# EAGLE design YOTSUBA_GNSS-receiver_MAX_ver.1.5b (EAGLE 9.6.2)
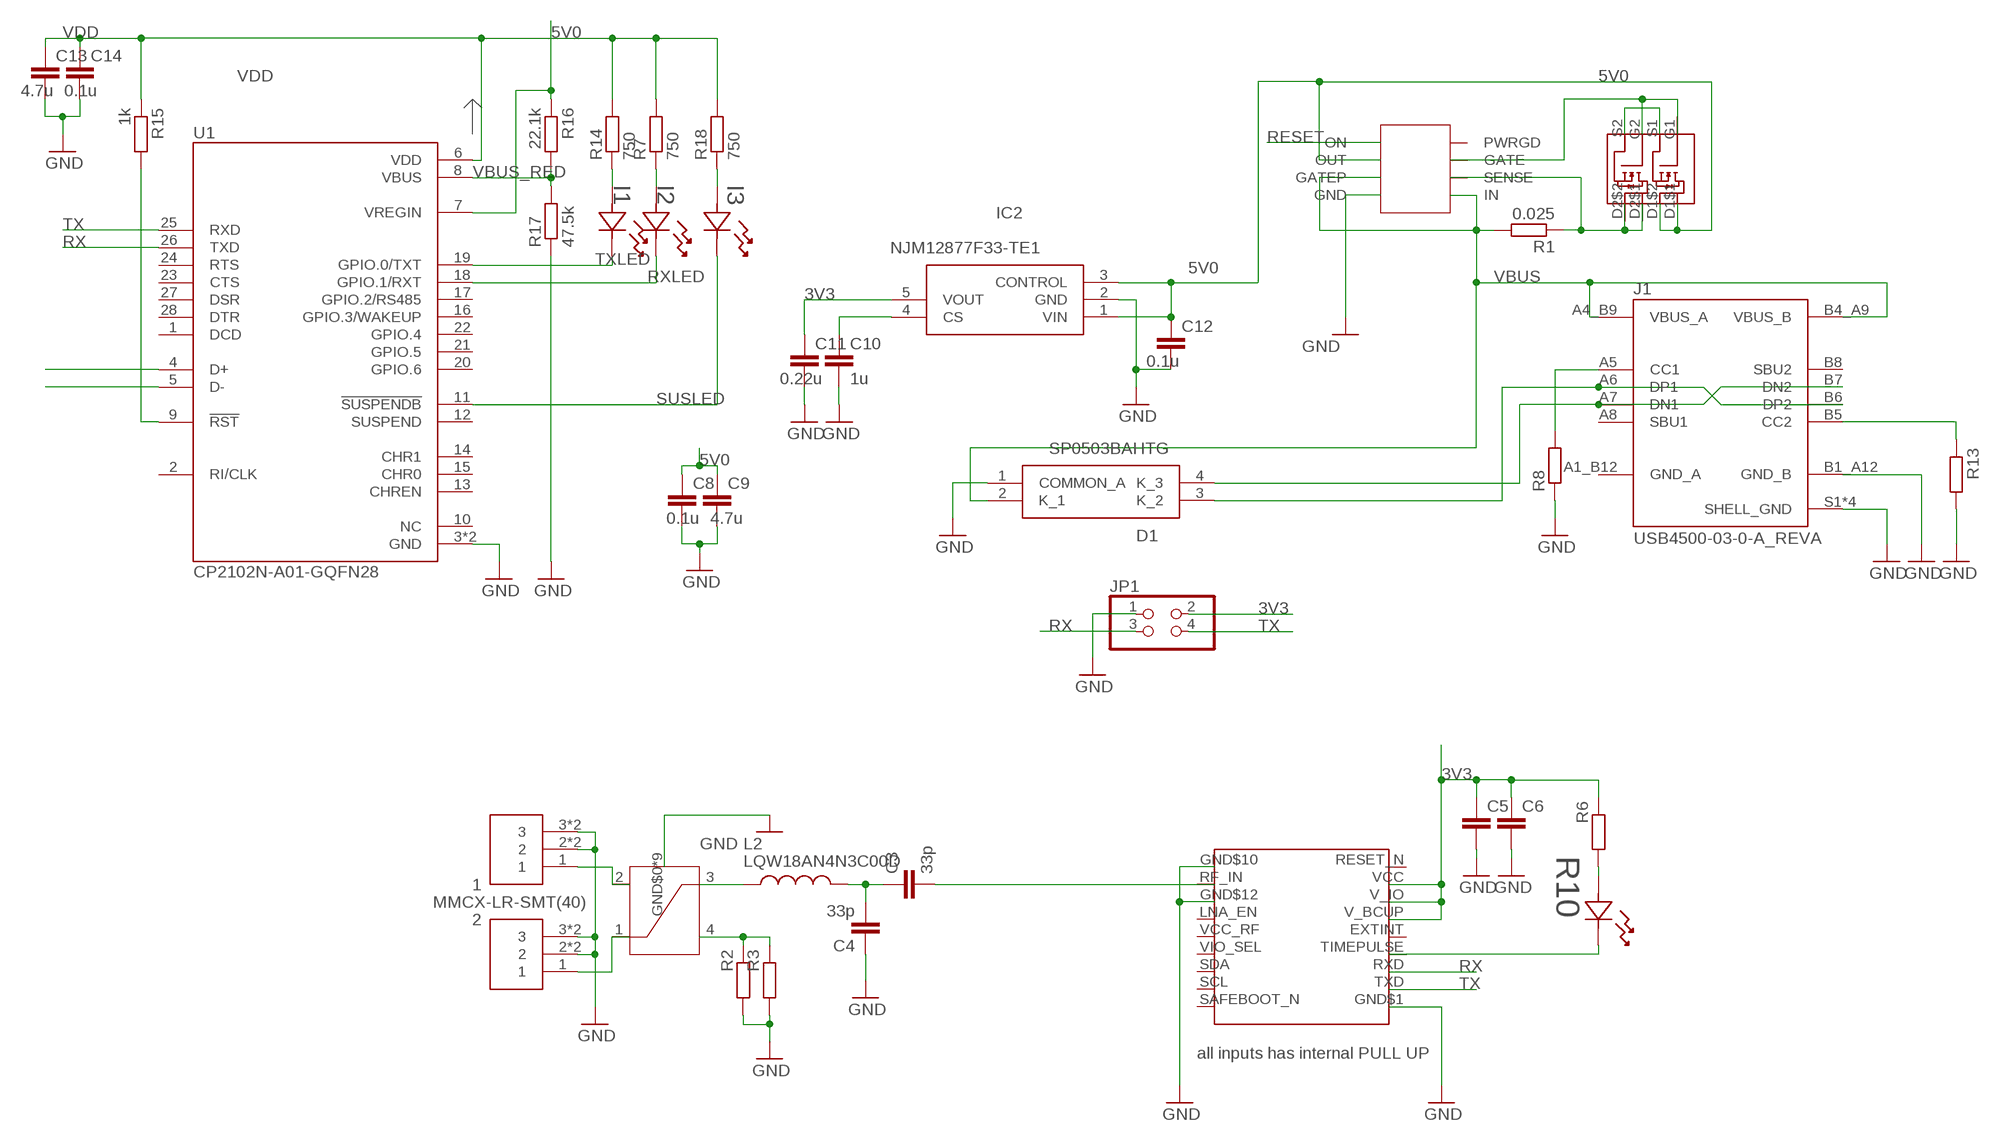
[diagram p0: schematic, sheet 1]

## Parts
1  MMCX-LR-SMT(40)  [MMCX-LR-SMT(40)]
2  MMCX-LR-SMT(40)  [MMCX-LR-SMT(40)]
C3  33p  C-EUC1608  [C1608]
C4  33p  C-EUC1608  [C1608]
C5  C-EUC1608  [C1608]
C6  C-EUC1608  [C1608]
C8  0.1u  C-EUC1608  [C1608]
C9  4.7u  C-EUC1608  [C1608]
C10  1u  C-EUC1608  [C1608]
C11  0.22u  C-EUC1608  [C1608]
C12  0.1u  C-EUC1608  [C1608]
C13  4.7u  C-EUC1608  [C1608]
C14  0.1u  C-EUC1608  [C1608]
D1  SP0503BAHTG  [SP0503BAHTG]
I1  SML-E12P8WT86  [LED_SMLD12_ROM]
I2  SML-E12P8WT86  [LED_SMLD12_ROM]
I3  SML-E12P8WT86  [LED_SMLD12_ROM]
IC2  NJM12877F33-TE1  [SOT95P280X120-5N]
J1  USB4500-03-0-A_REVA  [GCT_USB4500-03-0-A_REVA]
JP1  PINHD-2X2  [2X02]
L2  LQW18AN4N3C00D  [INDC1608X100N]
R1  0.025  R-EU_R0603  [R0603]
R2  R-EU_R0603  [R0603]
R3  R-EU_R0603  [R0603]
R6  R-EU_R0603  [R0603]
R7  750  R-EU_R0603  [R0603]
R8  R-EU_R0603  [R0603]
R10  SML-E12P8WT86  [LED_SMLD12_ROM]
R13  R-EU_R0603  [R0603]
R14  750  R-EU_R0603  [R0603]
R15  1k  R-EU_R0603  [R0603]
R16  22.1k  R-EU_R0603  [R0603]
R17  47.5k  R-EU_R0603  [R0603]
R18  750  R-EU_R0603  [R0603]
U1  CP2102N-A01-GQFN28  [QFN50P500X500X80-29N]
U$1  MAX_M10S  [MAX-M10S]
U$3  HC125.A  [HC125.A]
U$7  DMG6898LSD  [SOIC127P600X150-8N]
U$8  LTC4361  [SOP65P280X100-8N]

## Nets
3V3 [POWER]: C5.1 C6.1 C11.1 IC2.5(VOUT) JP1.2 R6.2 U$1.V_BCUP(V_BCKP) U$1.V_IO U$1.VCC
5V0 [POWER]: C8.1 C9.1 C12.1 IC2.1(VIN) IC2.3(CONTROL) R16.1 U1.7(VREGIN) U$7.D1$1 U$7.D1$2 U$8.OUT
D+: D1.3(K_2) J1.A6(DP1) J1.B6(DP2) U1.4(D+)
D-: D1.4(K_3) J1.A7(DN1) J1.B7(DN2) U1.5(D-)
GND [gnd]: 1.2 1.3 1.4 1.5 2.2 2.3 2.4 2.5 C4.1 C5.2 C6.2 C8.2 C9.2 C10.2 C11.2 C12.2 C13.2 C14.2 D1.1(COMMON_A) IC2.2(GND) J1.B1_A12(GND_B) J1.S1(SHELL_GND) J1.S2(SHELL_GND) J1.S3(SHELL_GND) J1.S4(SHELL_GND) JP1.1 R2.1 R3.1 R8.1 R13.2 R17.1 U1.3(GND) U1.29(GND) U$1.GND$1 U$1.GND$10 U$1.GND$12 U$3.GND$0(GND) U$3.GND$1(GND) U$3.GND$2(GND) U$3.GND$3(GND) U$3.GND$4(GND) U$3.GND$5(GND) U$3.GND$6(GND) U$3.GND$7(GND) U$3.GND$8(GND) U$8.GND
N$1 [1.1mm]: 1.1 U$3.2
N$2 [1.1mm]: 2.1 U$3.1
N$4: C10.1 IC2.4(CS)
N$5: I2.2 R7.1
N$6 [50Ω]: R2.2 R3.2 U$3.4
N$7 [50Ω]: L2.1 U$3.3
N$10 [50Ω]: C3.2 U$1.RF_IN
N$13: I1.2 R14.1
N$14: R10.1 U$1.TIMEPULSE
N$15: R6.1 R10.2
N$16: I3.2 R18.1
N$17 [50Ω]: C3.1 C4.2 L2.2
N$19: U$7.S1 U$7.S2
N$20: R1.1 U$7.D2$1 U$7.D2$2 U$8.SENSE
N$21: J1.B5(CC2) R13.1
N$22: U$7.G1 U$7.G2 U$8.GATE
N$23: J1.A5(CC1) R8.2
N$27: R15.2 U1.9(!RST)
RESET [gnd]: U$8.ON
RX: JP1.3 U1.26(TXD) U$1.RXD
RXLED: I2.1 U1.18(GPIO.1/RXT)
SUSLED: I3.1 U1.11(!SUSPENDB)
TX: JP1.4 U1.25(RXD) U$1.TXD
TXLED: I1.1 U1.19(GPIO.0/TXT)
VBUS: D1.2(K_1) J1.A4_B9(VBUS_A) J1.B4_A9(VBUS_B) R1.2 U$8.GATEP U$8.IN
VBUS_RED: R16.2 R17.2 U1.8(VBUS)
VDD: C13.1 C14.1 R7.2 R14.2 R15.1 R18.2 U1.6(VDD)
Unconnected: J1.A8(SBU1) J1.B8(SBU2) U1.1(DCD) U1.2(RI/CLK) U1.10(NC) U1.12(SUSPEND) U1.13(CHREN) U1.14(CHR1) U1.15(CHR0) U1.16(GPIO.3/WAKEUP) U1.17(GPIO.2/RS485) U1.20(GPIO.6) U1.21(GPIO.5) U1.22(GPIO.4) U1.23(CTS) U1.24(RTS) U1.27(DSR) U1.28(DTR) U$1.EXTINT U$1.LNA_EN U$1.RESET_N U$1.SAFEBOOT_N U$1.SCL U$1.SDA U$1.VCC_RF U$1.VIO_SEL U$8.PWRGD

## Notes on the sheet
- all inputs has internal PULL UP

## Power pins joined to a net without a drawn wire
GND: J1.A1_B12(GND_A)

## Library data of the parts
1 2 = MMCX-LR-SMT(40):MMCX-LR-SMT(40)
C3-C6 C8-C14 = rcl:C-EU: CAPACITOR, European symbol; SPICEPREFIX: C
D1 = SamacSys_Parts:SP0503BAHTG: ESD Suppressors / TVS Diodes TVS AVAL DIODE SMT Source: Datasheet <https://nl.mouser.com/datasheet/2/240/Littelfuse_TVS_Diode_Array_SP05_Datasheet.pdf-777043.pdf>; ARROW_PART_NUMBER: SP0503BAHTG; ARROW_PRICE-STOCK: https://www.arrow.com/en/products/sp0503bahtg/littelfuse?region=europe; DESCRIPTION: ESD Suppressors / TVS Diodes TVS AVAL DIODE SMT; HEIGHT: 1.22mm; MANUFACTURER_NAME: LITTELFUSE; MANUFACTURER_PART_NUMBER: SP0503BAHTG; MOUSER_PART_NUMBER: 576-SP0503BAHTG; MOUSER_PRICE-STOCK: https://www.mouser.co.uk/ProductDetail/Littelfuse/SP0503BAHTG?qs=uD%2FdkN7XIa0NTYXwHdELYA%3D%3D
I1-I3 R10 = LED_1608_2:SML-E12P8WT86; COPYRIGHT: Copyright (C) 2023 Ultra Librarian. All rights reserved.; DIGI-KEY_PART_NUMBER_1: 511-1585-1-ND; DIGI-KEY_PART_NUMBER_2: 511-1585-2-ND; DIGI-KEY_PART_NUMBER_3: 511-1585-6-ND; MANUFACTURER_PART_NUMBER: SML-E12P8WT86; MFR_NAME: ROHM Semiconductor
IC2 = SamacSys_Parts:NJM12877F33-TE1: LDO Voltage Regulators LDO ADJ High Ripple 3.3V Vo 1% 200mA Source: Datasheet <https://datasheet.datasheetarchive.com/originals/distributors/Datasheets_SAMA/e828f6bebe4b9138c37698b69374413c.pdf>; DESCRIPTION: LDO Voltage Regulators LDO ADJ High Ripple 3.3V Vo 1% 200mA; HEIGHT: 1.2mm; MANUFACTURER_NAME: New Japan Radio; MANUFACTURER_PART_NUMBER: NJM12877F33-TE1; MOUSER_PART_NUMBER: 513-NJM12877F33-TE1; MOUSER_PRICE-STOCK: https://www.mouser.com/Search/Refine.aspx?Keyword=513-NJM12877F33-TE1
J1 = USB4500-03-0-A_REVA:USB4500-03-0-A_REVA; DESCRIPTION: USB-C (USB TYPE-C) USB 2.0 Receptacle Connector 24 (16+8 Dummy) Position Board Edge, Cutout; Surface Mount; Through Hole, Right Angle; DIGI-KEY_PART_NUMBER: 2073-USB4500-03-0-ATR-ND; MF: Global Connector Technology; MP: USB4500-03-0-A; PACKAGE: None; PURCHASE-URL: https://pricing.snapeda.com/search/part/USB4500-03-0-A/?ref=eda
JP1 = pinhead:PINHD-2X2: PIN HEADER
L2 = LQW18AN4N3C00D:LQW18AN4N3C00D: 2.3 NH +/-.1NH; DESCRIPTION: Inductor with Inductance: 4.3nH Tol. +/-0.2nH, Package: 0603 (1608); DIGIKEY_PART_NUMBER: 490-6896-2-ND; MF: Murata; MP: LQW18AN4N3C00D; PACKAGE: 1608 Murata; PURCHASE-URL: https://pricing.snapeda.com/search?q=LQW18AN4N3C00D&ref=eda
R1-R3 R6-R8 R13-R18 = rcl:R-EU_: RESISTOR, European symbol; SPICEPREFIX: R
U1 = CP2102N-A01-GQFN28:CP2102N-A01-GQFN28: USB Bridge, USB to UART USB 2.0 UART Interface 28-QFN (5x5) Check availability <https://pricing.snapeda.com/parts/CP2102N-A01-GQFN28/Silicon%20Labs/view-part?ref=eda>; AVAILABILITY: In Stock; DESCRIPTION: USB Bridge, USB to UART USB 2.0 UART Interface 28-QFN (5x5); MF: Silicon Labs; MP: CP2102N-A01-GQFN28; PACKAGE: QFN-28 Silicon Labs; PRICE: None; PURCHASE-URL: https://pricing.snapeda.com/search/part/CP2102N-A01-GQFN28/?ref=eda
U$1 = MAX-M10S:MAX_M10S
U$3 = HC125.A:HC125.A
U$7 = DMG6898LSD:DMG6898LSD
U$8 = ltc4361:LTC4361

## Net classes
0 default: clearance 0.121 mm
2 gnd: clearance 0.21 mm to class 1, clearance 0.254 mm
3 POWER: width 0.127 mm, clearance 0.025 mm
4 1.1mm: clearance 0.247 mm to class 1

## Board
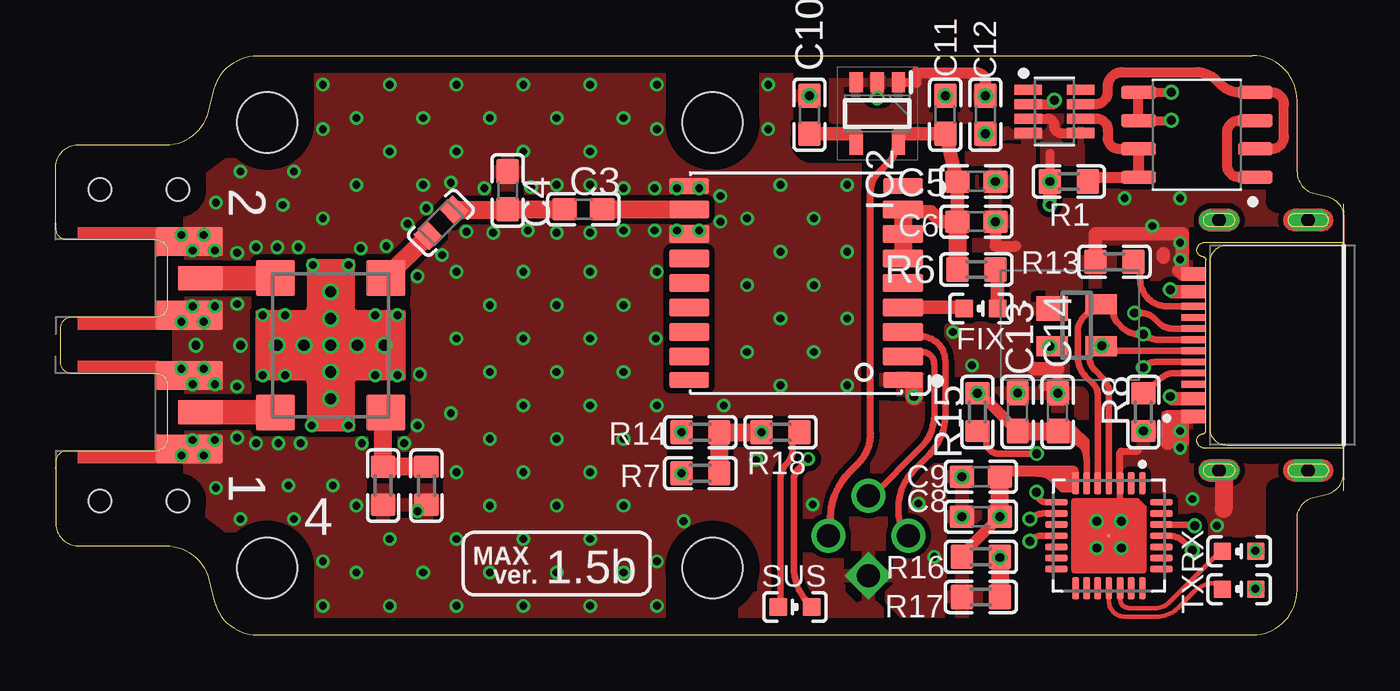
[diagram p1: board, top side]
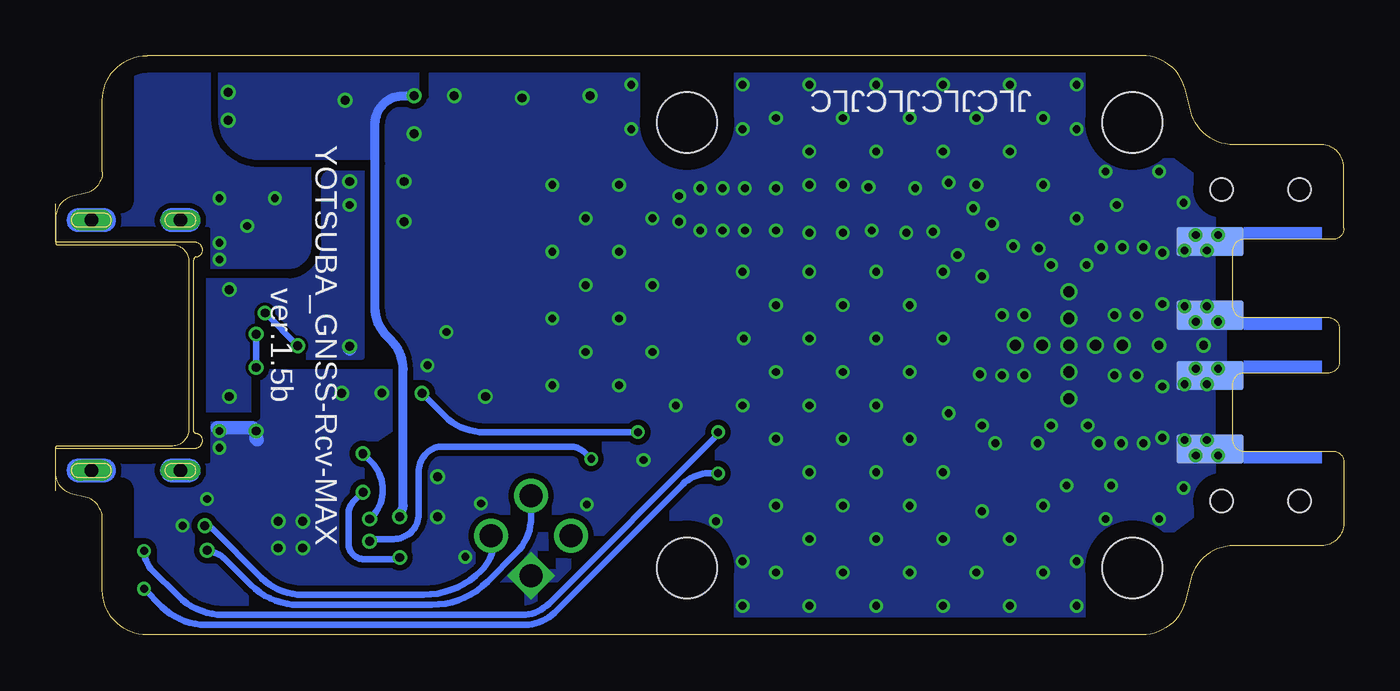
[diagram p2: board, bottom side, seen from below]

Size 57.85 x 26 mm. Coordinates in mm from the lower left corner, seen from the top.
Outline: 1,4 4.94,4 arc-76 6.88,2.48 7.12,1.51 arc76 9.06,0 53.75,0 arc90 55.75,2 55.75,5.21 arc-77 56.52,6.18 57.08,6.32 arc77 57.85,7.29 57.85,8.4 arc90 57.75,8.5 52.6,8.5 arc-90 51.85,9.25 51.85,16.75 arc-90 52.6,17.5 57.75,17.5 arc90 57.85,17.6 57.85,18.71 arc77 57.08,19.68 56.52,19.82 arc-77 55.75,20.79 55.75,24 arc90 53.75,26 9.06,26 arc76 7.12,24.48 6.88,23.52 arc-76 4.94,22 1,22 arc90 0,21 0,18.25 arc90 0.5,17.75 4.5,17.75 arc-90 5,17.25 5,14.75 arc-90 4.5,14.25 0.7,14.25 arc90 0.2,13.75 0.2,12.25 arc90 0.7,11.75 4.5,11.75 arc-90 5,11.25 5,8.75 arc-90 4.5,8.25 0.5,8.25 arc90 0,7.75 0,5 arc90 1,4
Copper layers (1*16): Top 0.035mm / dielectric 0.2104mm / Bottom 0.035mm
Design rules "JLCPCB_2L *": minimum track width 5mil, minimum drill 0.15mm, track to track 5mil, track to pad 5mil, pad to pad 5mil, via to via 5mil, smd to smd 5mil, copper to edge 30mil, drill to drill 0.5mm, minimum pad ring 0.13mm, minimum via ring 0.13mm, stop-mask expansion 0.038mm, vias tented up to drill 0.4mm, thermal gap 10mil
Holes 1 mm at 2,6 5.5,6 2,20 5.5,20
Holes 2.7 mm at 9.5,3 9.5,23 29.5,23 29.5,3
tRestrict: 67 lines
bRestrict: 35 lines

### Footprints (pad centres in the part's own frame; a part is rotated, then mirrored left to right if it is on the bottom)
MMCX-LR-SMT(40) = smd 1.1 x 2: 1 0,-2 | smd 1.3 x 3: 2 1.65,-1.5; 3 -1.65,-1.5 | smd 1.3 x 3 bottom: 4 -1.65,-1.5; 5 1.65,-1.5
C1608 = smd 1.1 x 1: 1 -0.85,0; 2 0.85,0
SP0503BAHTG = smd 1.1 x 1.4: 1 -0.75,-1.1 | smd 0.9 x 1.4: 2 0.95,-1.1; 3 0.95,1.1; 4 -0.95,1.1
LED_SMLD12_ROM = smd 0.8 x 0.8: 1 -0.75,0; 2 0.75,0
SOT95P280X120-5N = smd 0.9 x 0.6: 1 -1.4,0.95; 2 -1.4,0; 3 -1.4,-0.95; 4 1.4,-0.95; 5 1.4,0.95
GCT_USB4500-03-0-A_REVA = smd 0.6 x 1.1: A1_B12 -3.2,5.15; A4_B9 -2.4,5.15; B1_A12 3.2,5.15; B4_A9 2.4,5.15 | smd 0.3 x 1.1: A5 -1.25,5.15; A6 -0.25,5.15; A7 0.25,5.15; A8 1.25,5.15; B5 1.75,5.15; B6 0.75,5.15; B7 -0.75,5.15; B8 -1.75,5.15 | drill 0.6 pad 0.95 long: S1 -5.62,0; S4 5.62,0 | drill 0.6 pad 0.8 long: S2 5.62,4; S3 -5.62,4
2X02 = drill 1.016 square: 1 -1.27,-1.27 | drill 1.016: 2 -1.27,1.27; 3 1.27,-1.27; 4 1.27,1.27
INDC1608X100N = smd 0.89 x 1.02: 1 -0.814,0; 2 0.814,0
R0603 = smd 1 x 1.1: 1 -0.85,0; 2 0.85,0
QFN50P500X500X80-29N = smd 1.01 x 0.3: 1 -2.36,1.5; 2 -2.36,1; 3 -2.36,0.5; 4 -2.36,0; 5 -2.36,-0.5; 6 -2.36,-1; 7 -2.36,-1.5; 15 2.36,-1.5; 16 2.36,-1; 17 2.36,-0.5; 18 2.36,0; 19 2.36,0.5; 20 2.36,1; 21 2.36,1.5 | smd 0.3 x 1.01: 8 -1.5,-2.36; 9 -1,-2.36; 10 -0.5,-2.36; 11 0,-2.36; 12 0.5,-2.36; 13 1,-2.36; 14 1.5,-2.36; 22 1.5,2.36; 23 1,2.36; 24 0.5,2.36; 25 0,2.36; 26 -0.5,2.36; 27 -1,2.36; 28 -1.5,2.36 | smd 0.127 x 0.127: 29 0,0
MAX-M10S = smd 1.8 x 0.8: EXTINT 4.8,0; GND$12 -4.8,2.2; LNA_EN -4.8,1.1; RF_IN -4.8,3.3; RXD 4.8,-2.2; SCL -4.8,-3.3; SDA -4.8,-2.2; TIMEPULSE 4.8,-1.1; TXD 4.8,-3.3; V_BCUP 4.8,1.1; V_IO 4.8,2.2; VCC 4.8,3.3; VCC_RF -4.8,0; VIO_SEL -4.8,-1.1 | smd 1.8 x 0.7: GND$1 4.8,-4.35; GND$10 -4.8,4.35; RESET_N 4.8,4.35; SAFEBOOT_N -4.8,-4.35
HC125.A = smd 1.625 x 1.75: 1 -3.022,2.475; 2 3.022,2.475; 3 3.022,-2.475; 4 -3.022,-2.475 | drill 0.5: GND$0 0,0; GND$1 0,2.4; GND$2 0,1.2; GND$3 0,-2.4; GND$4 0,-1.2; GND$5 -2.4,0; GND$6 -1.2,0; GND$7 2.4,0; GND$8 1.2,0
SOIC127P600X150-8N = smd 1.58 x 0.589: D1$1 -2.625,1.905; D1$2 -2.625,0.635; D2$1 -2.625,-0.635; D2$2 -2.625,-1.905; G1 2.625,1.905; G2 2.625,-0.635; S1 2.625,0.635; S2 2.625,-1.905
SOP65P280X100-8N = smd 1.237 x 0.459: GATE 1.187,0.325; GATEP -1.187,-0.325; GND -1.187,-0.975; IN 1.187,-0.975; ON -1.187,0.975; OUT -1.187,0.325; PWRGD 1.187,0.975; SENSE 1.187,-0.325

### Placement (x,y rotation side)
1  4.5,16 90 top
2  4.5,10 90 top
C3  23.7,19.1 0 top
C4  20.3,19.95 270 top
C5  41.35,20.35 0 top
C6  41.35,18.55 0 top
C8  41.55,5.3 180 top
C9  41.55,7.1 180 top
C10  33.85,23.35 90 top
C11  39.95,23.35 90 top
C12  41.75,23.35 270 top
C13  43.2,10 90 top
C14  45,10 90 top
D1  45.85,13.9 270 top
I1  53.15,3.75 0 top
I2  53.15,2.05 0 top
I3  33.2,1.25 180 top
IC2  36.9,23.4 270 top
J1  56.25,13 90 top
JP1  36.5,4.45 45 top
L2  17.3,18.5 45 top
R1  45.5,20.35 180 top
R2  14.7,6.7 90 top
R3  16.65,6.7 90 top
R6  41.35,16.4 180 top
R7  28.95,7.25 0 top
R8  48.85,10 90 top
R10  41.55,14.65 0 top
R13  47.55,16.75 180 top
R14  28.95,9.1 0 top
R15  41.4,10 270 top
R16  41.55,3.5 0 top
R17  41.55,1.7 0 top
R18  32.55,9.1 180 top
U1  47.3,4.45 270 top
U$1  33.25,15.8 0 top
U$3  12.35,13 90 top
U$7  51.25,22.45 0 top
U$8  44.85,23.5 0 top

### Tracks (layer width: path | path; a pad name or v marks a point on that pad's centre or on a via)
3V3
  Top 0.305: 34.59,4.57 JP1.2 arc45 34.7,4.93 34.8,5.17 34.8,5.23 arc-45 35.66,7.31 36.04,7.69 arc45 36.6,9.04 36.6,19.91 arc-45 36.94,20.74 37.48,21.28 arc45 37.7,21.81 37.7,21.85 IC2.5 37.85,22.15 37.8,22.2 37.8,22.25
  Top 0.6: U$1.VCC 38.15,19 39.3,19 39.75,18.55 C6.1 C5.1 C11.1 37.85,22.5 IC2.5
  Top 0.8: U$1.VCC U$1.V_IO U$1.V_BCUP | C6.1 R6.2
5V0  (via drill 0.4)
  Top 0.305: 42.4,7.35 C9.1 | 45.5,6.55 45.2,6.55 45.1,6.65 | 45.5,6.55 45.8,6.55 U1.7 45.8,7.25 45.7,7.35 | 45,6.75 44.72,7.03 arc45 44.19,7.25 44.05,7.25 43.95,7.35 | 45,6.75 45.1,6.65 | 45.5,6.55 45.5,7.3 45.45,7.35 | 45.2,7.35 45.2,6.75 45.1,6.65 | 45,7.4 45,6.75
  Top 0.4: R16.1 40.7,3.6 | U$7.D1$1 v50.1,24.36 | U$7.D1$2 50.1,23.09 v50.1,23.1 | IC2.1 38.65,24.8
  Top 0.45: U$7.D1$2 U$7.D1$1 | U$8.OUT 44.85,23.82 v44.85,24
  Top 0.5: 45.7,7.35 45.45,7.35 45.2,7.35 43.95,7.35 42.4,7.35 | IC2.1 37.84,24.9 | C8.1 40.7,3.6 | 38.65,24.8 38.65,25.24 41.33,25.24 arc-90 41.75,24.82 C12.1
  Top 0.8: C8.1 C9.1
  Bottom 0.4: C8.1 42.4,5.47 arc-45 42.25,5.83 42.25,11.93 arc-45 42.78,13.22 42.97,13.41 arc45 43.51,14.7 43.51,22.93 arc90 42.24,24.2 C12.1
  other vias: 42.4,5.3 41.75,24.2
  pour Bottom: 41.75,24.3 41.75,25.4 50.75,25.4 50.75,22.5 arc-90 49.75,21.5 43.55,21.5 43.55,23.3 arc90 42.55,24.3
  pour Top: 34.9,25.5 34.9,23.15 42.8,23.15 42.8,25.5
D+  (via drill 0.4)
  Top 0.3: U1.4 47.3,10.89 arc45 47.04,11.51 46.68,11.87 arc-45 46.41,12.54 46.84,12.97 v46.98,12.97 | v46.98,12.97 D1.3 | v46.98,12.97 47.27,12.97 47.5,12.75 J1.A6 | J1.B6 50.14,13.75 arc-45 49.56,13.99 49.36,14.19 arc45 48.73,14.45 v48.45,14.45
  Bottom 0.3: v48.45,14.45 v46.98,12.97
D-  (via drill 0.4)
  Top 0.3: U1.5 46.8,10.77 arc45 46.59,11.27 46.25,11.61 arc-45 45.9,12.45 45.9,13.59 arc-45 46.19,14.29 46.75,14.85 D1.4 47.1,14.85 47.5,14.45 arc45 47.68,14.02 47.93,13.77 arc45 48.59,13.5 v48.85,13.5 48.81,13.54 arc45 49.51,13.25 J1.A7 | J1.B7 49.39,12.25 arc45 48.9,12.05 v48.85,12
  Bottom 0.3: v48.85,13.5 v48.85,12
GND  (via drill 0.35, 0.4)
  Top 0.3: C14.2 | C14.2 | v43.2,10.86 C13.2 | U1.3 47.8,5.15 v47.85,5.1
  Top 0.305: U1.3 47.8,8.2 47.85,8.25 48.6,8.25
  Top 0.4: 44.35,11.15 45,11.15 C14.2 45,11.95 | v18,4.3 18.05,4.35
  Top 0.45: IC2.2 v36.9,24.1 | U$1.GND$1 38.2,11.45 38.55,11.1
  Top 0.5: C6.2 42.2,17.45 43.1,17.45 | J1.S3 52.45,7.38
  Top 0.6: J1.B1_A12 50.6,16.2 50.44,16.36 50.59,16.36 50.59,18 46.7,18 R13.2 | 49.75,16.95 49.75,17.1 | C8.2 v40.7,5.29 | 45,11.95 43.95,11.95 | 50.65,9.8 49.95,9.8 49.95,8.6 | 50.65,9.8 J1.A1_B12 50.75,9.8 50.6,9.65 50.6,8.65 50.5,8.65 50.43,8.72 50.43,9.77 50.62,9.77 50.65,9.8
  Top 0.8: 38.55,11.1 v38.55,10.7 | 52.45,7.38 52.45,5.65
  Bottom 0.3: 48.8,8.75 48.85,8.7 | C14.2 | C14.2 | v43.2,10.86 43.14,10.86 43.1,10.9 | C6.2 42.25,18.6 | C12.2 41.8,22.5 | C11.2 39.9,24.25 | C10.2 33.8,24.15
  Bottom 0.6: v40.7,5.29 40.75,5.29 40.75,5.3 | C9.2 40.75,7.1 | 48.8,8.75 48.85,8.8 R8.1 49,9.3 50.6,9.3
  other vias: 12,24.7 12,1.3 12,3.3 12,22.7 10.7,20.8 8.3,20.8 10.7,5.2 8.3,5.2 6.15,14.75 6.15,11.25 6.15,17.25 6.15,8.75 6.3,13 7.2,19.4 7.2,6.6 12.45,6.7 47.85,3.9 46.75,3.9 46.75,5.1 40.7,7.1 45,10.85 42.2,20.35 42.2,18.55 41.75,22.5 39.95,24.2 33.85,24.2 48.85,9.15 50.5,9.15 51.05,6.1 40.3,13.6 41.15,12.1 38.75,5.9 39.45,3.5 18,1.3 21,1.3 24,1.3 27,1.3 19.5,2.8 22.5,2.8 25.5,2.8 21,4.3 24,4.3 27,3.3 15,24.7 18,24.7 21,24.7 24,24.7 27,24.7 16.5,23.2 19.5,23.2 25.5,23.2 27,22.7 22.5,5.8 32,24.7 35.55,20.2 34.05,18.7 35.55,17.2 32.55,14.2 34.05,15.7 35.55,14.2 34.05,12.7 31.05,12.7 31.05,15.7 32.55,11.2 35.55,11.2 16.25,9.4 32,22.7 7.15,17.25 9,17.4 7.15,14.75 9.3,14.35 7.15,11.25 9.3,11.65 7.15,8.75 8.15,8.85 9.95,17.4 10,8.6 10.9,17.4 11,8.6 52.15,4.9 50.5,8.4 50.5,16.85 50.5,17.6 50.5,19.6 49.25,18.35 48,19.6 16.25,5.55 32.55,17.2 31.05,18.7 32.55,20.2 25.5,5.8 19.5,5.8 21,7.3 16.5,2.8 15,1.3 13.5,2.8 15,4.3 13.5,5.8 13.75,8.6 18,7.3 24,7.3 25.5,8.8 27,10.3 30,10.3 22.5,23.2 21,21.7 13.5,23.2 24,21.7 26.9,20.05 26.9,18.15 27.9,20.05 27.9,18.15 28.9,18.15 28.9,20.05 29.85,19.7 29.85,18.55 13.7,17.35 16.25,16.1 16.35,11.7 17.75,9.95 8.15,17.15 8.15,14.85 8.15,11.15 9,8.6 10.3,11.65 10.3,14.35 14.35,14.35 15.35,14.35 15.35,11.65 14.35,11.65 11.5,9.4 13.15,9.4 13.15,16.6 11.55,16.6 15.65,8.6 8.3,13 6.65,8.05 6.65,11.95 6.65,14.05 6.65,17.95 5.65,11.95 5.65,8.05 5.65,14.05 5.65,17.95 10.2,19.3 10.45,6.7 31.45,7.85 34,5.85 28.2,5.1 15,21.7 18,21.7 16.5,20.2 13.5,20.2 12,18.7 19.5,8.8 19.5,11.8 21,10.3 22.5,8.8 24,10.3 22.5,11.8 25.5,11.8 24,13.3 21,13.3 18,13.3 19.5,14.8 18,16.3 19.65,18.05 21,16.3 22.5,14.8 24,16.3 22.5,18.05 25.5,18.15 27,16.3 25.5,14.8 26.95,13.3 22.5,20.2 25.5,20.05 24,20.2 24,18.05 21.2,18.15 21.35,20.1 18.45,18.1 19.25,20.05 17.35,17.05 14.85,17.45 16.65,19.15 15.8,18.45 17.75,20.3
  pour Top: -2.8,28.55 58.9,28.55 arc-90 59.9,27.55 59.9,-2.25 -2.8,-2.25
  pour Bottom: -1.75,27.65 58.85,27.65 58.85,-1.3 -1.75,-1.3
  pour Bottom (no thermals): 4.65,13.7 2.85,13.7 2.85,13.8 4.65,13.8
N$1
  Top 1.1: 1.1 9.85,16 U$3.2
N$2
  Top 1.1: U$3.1 9.85,10 2.1
N$4
  Top 0.6: 34.05,22.3 C10.1 35.95,22.5 IC2.4
N$5  (via drill 0.35)
  Top 0.3: I2.2 v53.88,2.07
  Bottom 0.3: v53.88,2.07 53.08,1.27 arc-45 51.1,0.45 36.78,0.45 arc-45 35.45,1 29.68,6.77 arc45 28.52,7.25 R7.1
  other vias: 28.1,7.25
N$6
  Top 0.8: U$3.4 14.68,9.83 14.68,7.58 R2.2 R3.2
N$7
  Top 0.8: 14.65,16.2 U$3.3 L2.1
N$8
  pour Top (no thermals): 18.9,14.2 18.3,13.4 18.3,14.2
N$9
  pour Top (no thermals): 21.2,13.4 21.8,13.4 22,13.6 22,14.05 21.85,14.2
N$10
  Top 0.8: C3.2 U$1.RF_IN
N$11
  pour Top (no thermals): 21.15,16.65 21.15,15.9 21.25,15.9 21.95,15.9 21.95,16.65
N$13  (via drill 0.35)
  Top 0.3: I1.2 v53.88,3.77
  Bottom 0.3: 53.84,3.82 53.84,3.81 v53.88,3.77 53.86,3.75 arc-45 53.51,2.9 52.36,1.75 arc-45 50.31,0.9 36.91,0.9 arc-45 35.7,1.4 28.17,8.93 arc-45 R14.1
  other vias: 28.1,9.1
N$14
  Top 0.6: R10.1 40.75,14.7 U$1.TIMEPULSE
N$15
  Top 0.6: R10.2 42.3,16.4 R6.1
N$16
  Top 0.3: R18.1 33.1,8.8 33.1,8.31 arc-45 32.84,7.69 arc45 32.55,6.99 32.55,1.35 I3.2
N$17
  Top 0.8: L2.2 20.32,19.08 C4.2 C3.1
N$19
  Top 0.45: U$7.S1 53.15,23.09 arc90 52.6,22.54 52.6,21.09 arc90 53.15,20.55 U$7.S2
N$20
  Top 0.3: R1.1 46.34,20.35 46.14,20.55
  Top 0.45: U$8.SENSE 46.75,23.18 arc-90 47.25,22.68 47.25,22.32 arc90 47.75,21.82 U$7.D2$1
  Top 0.5: U$7.D2$1 U$7.D2$2 46.14,20.55
N$21
  Top 0.3: R13.1 48.6,16.75 48.7,16.65 48.7,15.99 arc45 49.08,15.09 arc45 49.89,14.75 49.9,14.75 J1.B5
N$22
  Top 0.45: U$8.GATE 46.7,23.82 arc90 47.25,24.38 47.25,24.61 arc-90 47.9,25.26 51.23,25.26 arc-45 52.13,24.89 52.29,24.73 arc45 53.19,24.36 U$7.G1 54.61,24.36 arc-90 55.16,23.8 55.16,22.36 arc-90 54.61,21.82 U$7.G2
N$23
  Top 0.3: J1.A5 50.26,11.75 arc45 49.56,11.46 49.25,11.15 49.15,11.15 R8.2
N$27  (via drill 0.4)
  Top 0.3: U1.9 44.35,5.45 arc45 v43.75,5.2 | v44.06,8.14 42.31,8.14 arc-90 41.8,8.65 41.8,8.95 41.6,9.15 R15.2
  Bottom 0.3: 43.8,5.25 v43.75,5.2 43.66,5.29 arc-45 43.16,6.5 arc-45 43.69,7.77 v44.06,8.14
RX  (via drill 0.4)
  Top 0.3: v51.15,4.9 arc45 51.03,4.95 U1.26 | U$1.RXD 38.25,13.4 38.85,13.4 arc-90 39.95,12.3 39.95,9.87 arc-45 39.19,8.04 38.54,7.39 arc45 37.85,5.72 37.85,5.54 arc45 JP1.3
  Bottom 0.3: v51.15,4.9 arc45 50.81,4.76 48.62,2.57 arc-45 46.76,1.8 41.33,1.8 arc-45 38.75,2.87 arc-45 38.15,4.31 JP1.3
RXLED
  Top 0.2: U1.18 47.3,1.53 arc90 48.02,0.81 49.41,0.81 arc45 50.42,1.23 51.09,1.91 arc-45 52.12,2.33 I2.1
SUSLED  (via drill 0.35, 0.4)
  Top 0.3: U1.11 44.32,4.45 arc45 43.75,4.21 v43.75,4.2 | I3.1 33.88,1.32 arc-45 33.15,3.09 33.15,6.96 arc-45 33.36,7.46 v33.8,7.9
  Bottom 0.3: v33.8,7.9 34.06,8.16 arc-45 34.76,8.45 40.48,8.45 arc-45 41.19,8.15 arc-45 41.55,7.29 41.55,5.42 arc90 42.67,4.3 43.51,4.3 arc-45 v43.75,4.2
TX  (via drill 0.4)
  Top 0.3: U1.25 49.99,4.45 arc-45 50.69,4.16 v51.05,3.8 | JP1.4 36.7,6.25 38.87,8.42 arc45 39.45,9.83 39.45,11.03 39.45,12.15 arc90 38.9,12.7 38.25,12.7 U$1.TXD
  Bottom 0.3: v51.05,3.8 50.97,3.71 arc45 50.28,3.43 49.1,2.25 arc-45 46.93,1.35 40.96,1.35 arc-45 38.46,2.38 37.16,3.68 arc-45 36.5,5.29 JP1.4
TXLED
  Top 0.2: U1.19 47.8,1.62 arc90 48.22,1.2 49.4,1.2 arc45 49.99,1.44 52.23,3.68
  Top 0.3: I1.1 52.33,3.68 52.23,3.68
VBUS  (via drill 0.35, 0.4)
  Top 0.3: J1.A4_B9 51.09,10.59 51.01,10.59 | D1.2 v44.65,12.95
  Top 0.4: 44.65,21.6 R1.2
  Top 0.45: U$8.GATEP 44.55,23.18 arc-90 44.85,22.88 44.85,22.82 arc90 45.15,22.52 U$8.IN
  Top 0.5: R1.2
  Top 0.6: J1.A4_B9 50.15,10.6 v50.05,10.7 | J1.B4_A9 50.15,15.4 v50.05,15.5 | R1.2 v44.65,19.3
  Bottom 0.6: 44.65,12.85 v44.65,12.95
  other vias: 44.65,20.35
  pour Bottom: 51.2,9.95 49.15,9.95 49.15,12.5 44.2,12.5 44.15,12.55 44.15,21 45.41,21 arc-90 45.8,20.61 45.8,17.62 arc90 47.07,16.35 51.2,16.35
  pour Top: 44.15,23.25 46.1,23.25 46.1,20.4 44.15,20.4
VBUS_RED  (via drill 0.4)
  Top 0.3: U1.8 44.5,5.95 arc-90 v44.05,6.4
  Top 0.4: R16.2 v42.4,3.48 v42.4,3.47
  Top 0.8: R16.2 R17.2
  Bottom 0.3: 42.47,3.4 44,3.4 arc90 44.7,4.1 44.7,5.44 arc45 44.48,5.97 v44.05,6.4
  Bottom 0.406: v42.4,3.47 42.47,3.4
VDD  (via drill 0.35, 0.4)
  Top 0.3: U1.6 46.3,7.9 arc90 45.44,8.76 45.55,8.76 | C14.1 45,9.45 45.55,9.45 | 45.55,9.45 45.85,9.15 | 45.85,9.15 46.25,8.75 | 46.25,8.75 arc90 46.3,8.7 46.3,7.85 | 45.55,9.45 45.55,8.76 | 45.55,8.76 45.55,8.75 45.85,8.75 | 45.85,8.75 46.25,8.75 | 45.85,9.15 45.85,8.75
  Top 0.305: 45.44,8.76 45.39,8.76 C14.1
  Top 0.5: C13.1 41.87,10.48 41.44,10.85 R15.1
  Top 0.8: C13.1 C14.1 | R18.2 R14.2 R7.2
  Bottom 0.3: R15.1 40.39,9.84 arc-45 38.58,9.09 R18.2
  other vias: 41.4,10.85 31.7,9.1

### Text on the board
tPlace: 2 | FIX | 1 | 4 | MAX | RX | ver. | 1.5b | SUS | TX
bPlace: YOTSUBA_GNSS-Rcv-MAX | ver.1.5b
bNames: JLCJLCJLCJLC